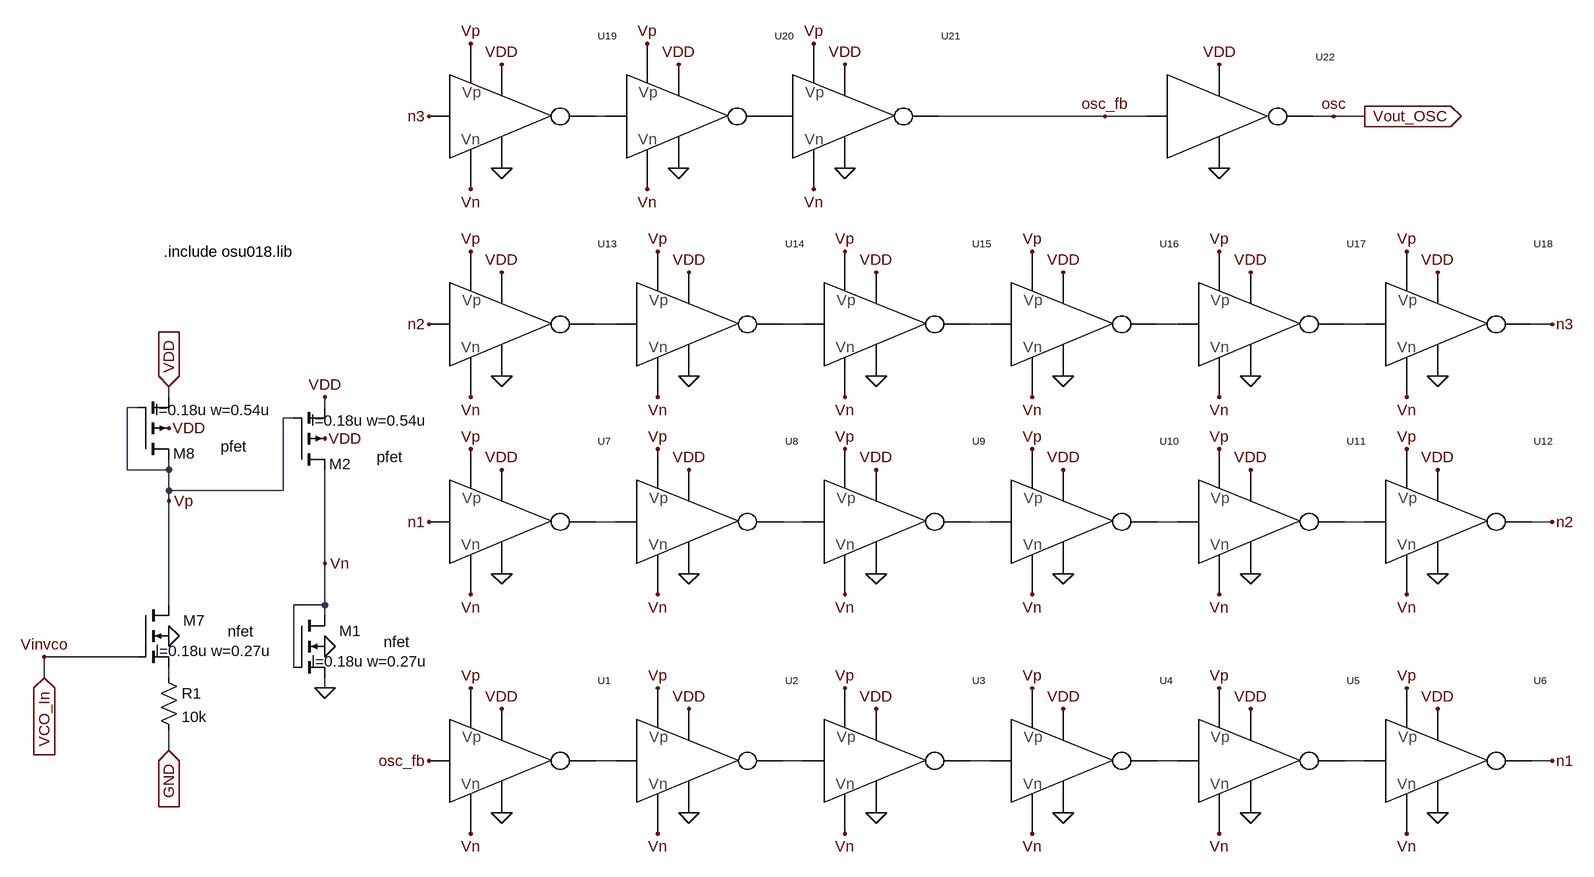
[diagram p0: schematic Z_VCO.asc]
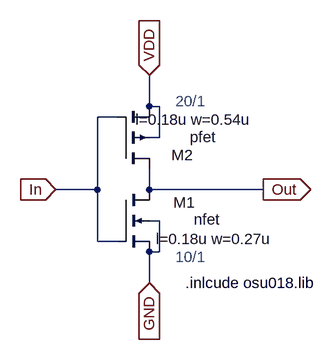
[diagram p1: sub-circuit inv_20_10.asc]
Z_VCO.asc, the LTspice schematic file:
Version 4
SHEET 1 6288 680
WIRE 1280 -1392 1264 -1392
WIRE 2048 -1392 1792 -1392
WIRE 2112 -1392 2048 -1392
WIRE 2400 -1392 2368 -1392
WIRE 2448 -1392 2400 -1392
WIRE 1296 -1072 1264 -1072
WIRE 1584 -1072 1552 -1072
WIRE 1872 -1072 1840 -1072
WIRE 2160 -1072 2128 -1072
WIRE 2448 -1072 2416 -1072
WIRE 2736 -1072 2704 -1072
WIRE 608 -960 608 -976
WIRE 560 -944 544 -944
WIRE 848 -944 848 -960
WIRE 800 -928 784 -928
WIRE 544 -848 544 -944
WIRE 608 -848 608 -864
WIRE 608 -848 544 -848
WIRE 608 -816 608 -848
WIRE 784 -816 784 -928
WIRE 784 -816 608 -816
WIRE 608 -800 608 -816
WIRE 1296 -768 1264 -768
WIRE 1584 -768 1552 -768
WIRE 1872 -768 1840 -768
WIRE 2160 -768 2128 -768
WIRE 2448 -768 2416 -768
WIRE 2736 -768 2704 -768
WIRE 848 -704 848 -848
WIRE 608 -640 608 -800
WIRE 848 -640 848 -704
WIRE 848 -640 800 -640
WIRE 848 -624 848 -640
WIRE 560 -560 416 -560
WIRE 800 -544 800 -640
WIRE 416 -528 416 -560
WIRE 608 -528 608 -544
WIRE 848 -512 848 -528
WIRE 608 -416 608 -448
WIRE 1296 -400 1264 -400
WIRE 1584 -400 1552 -400
WIRE 1872 -400 1840 -400
WIRE 2160 -400 2128 -400
WIRE 2448 -400 2416 -400
WIRE 2736 -400 2704 -400
FLAG 416 -560 Vinvco
FLAG 608 -592 0
FLAG 608 -912 VDD
FLAG 608 -800 Vp
FLAG 1120 -480 VDD
FLAG 1120 -320 0
FLAG 1072 -512 Vp
FLAG 1072 -288 Vn
FLAG 1408 -480 VDD
FLAG 1408 -320 0
FLAG 1360 -512 Vp
FLAG 1360 -288 Vn
FLAG 1696 -480 VDD
FLAG 1696 -320 0
FLAG 1648 -512 Vp
FLAG 1648 -288 Vn
FLAG 1984 -480 VDD
FLAG 1984 -320 0
FLAG 1936 -512 Vp
FLAG 1936 -288 Vn
FLAG 2272 -480 VDD
FLAG 2272 -320 0
FLAG 2224 -512 Vp
FLAG 2224 -288 Vn
FLAG 2560 -480 VDD
FLAG 2560 -320 0
FLAG 2512 -512 Vp
FLAG 2512 -288 Vn
FLAG 1120 -1472 VDD
FLAG 1120 -1312 0
FLAG 1072 -1504 Vp
FLAG 1072 -1280 Vn
FLAG 2224 -1472 VDD
FLAG 2224 -1312 0
FLAG 2400 -1392 osc
FLAG 2048 -1392 osc_fb
FLAG 1008 -400 osc_fb
FLAG 2736 -400 n1
FLAG 1008 -1392 n3
FLAG 608 -976 VDD
IOPIN 608 -976 In
FLAG 608 -416 GND
IOPIN 608 -416 In
FLAG 416 -528 VCO_In
IOPIN 416 -528 In
FLAG 2448 -1392 Vout_OSC
IOPIN 2448 -1392 Out
FLAG 848 -576 0
FLAG 848 -896 VDD
FLAG 848 -960 VDD
FLAG 848 -512 0
FLAG 848 -704 Vn
FLAG 1120 -848 VDD
FLAG 1120 -688 0
FLAG 1072 -880 Vp
FLAG 1072 -656 Vn
FLAG 1408 -848 VDD
FLAG 1408 -688 0
FLAG 1360 -880 Vp
FLAG 1360 -656 Vn
FLAG 1696 -848 VDD
FLAG 1696 -688 0
FLAG 1648 -880 Vp
FLAG 1648 -656 Vn
FLAG 1984 -848 VDD
FLAG 1984 -688 0
FLAG 1936 -880 Vp
FLAG 1936 -656 Vn
FLAG 2272 -848 VDD
FLAG 2272 -688 0
FLAG 2224 -880 Vp
FLAG 2224 -656 Vn
FLAG 2560 -848 VDD
FLAG 2560 -688 0
FLAG 2512 -880 Vp
FLAG 2512 -656 Vn
FLAG 1008 -768 n1
FLAG 2736 -768 n2
FLAG 1120 -1152 VDD
FLAG 1120 -992 0
FLAG 1072 -1184 Vp
FLAG 1072 -960 Vn
FLAG 1408 -1152 VDD
FLAG 1408 -992 0
FLAG 1360 -1184 Vp
FLAG 1360 -960 Vn
FLAG 1696 -1152 VDD
FLAG 1696 -992 0
FLAG 1648 -1184 Vp
FLAG 1648 -960 Vn
FLAG 1984 -1152 VDD
FLAG 1984 -992 0
FLAG 1936 -1184 Vp
FLAG 1936 -960 Vn
FLAG 2272 -1152 VDD
FLAG 2272 -992 0
FLAG 2224 -1184 Vp
FLAG 2224 -960 Vn
FLAG 2560 -1152 VDD
FLAG 2560 -992 0
FLAG 2512 -1184 Vp
FLAG 2512 -960 Vn
FLAG 1008 -1072 n2
FLAG 2736 -1072 n3
FLAG 1392 -1472 VDD
FLAG 1344 -1504 Vp
FLAG 1392 -1312 0
FLAG 1344 -1280 Vn
FLAG 1648 -1472 VDD
FLAG 1600 -1504 Vp
FLAG 1648 -1312 0
FLAG 1600 -1280 Vn
SYMBOL nmos4 560 -640 R0
WINDOW 0 104 24 Right 2
WINDOW 3 179 41 Right 2
WINDOW 123 207 71 Right 2
SYMATTR InstName M7
SYMATTR Value nfet
SYMATTR Value2 l=0.18u w=0.27u
SYMBOL pmos4 560 -864 M180
WINDOW 0 88 9 Right 2
WINDOW 3 168 20 Right 2
WINDOW 123 206 76 Right 2
SYMATTR InstName M8
SYMATTR Value pfet
SYMATTR Value2 l=0.18u w=0.54u
SYMBOL CS_inv 1040 -464 R0
SYMATTR InstName U1
SYMBOL CS_inv 1328 -464 R0
SYMATTR InstName U2
SYMBOL CS_inv 1616 -464 R0
SYMATTR InstName U3
SYMBOL CS_inv 1904 -464 R0
SYMATTR InstName U4
SYMBOL CS_inv 2192 -464 R0
SYMATTR InstName U5
SYMBOL CS_inv 2480 -464 R0
SYMATTR InstName U6
SYMBOL CS_inv 1040 -1456 R0
SYMATTR InstName U19
SYMBOL INV_20_10 2144 -1456 R0
SYMATTR InstName U22
SYMBOL nmos4 800 -624 R0
WINDOW 0 104 24 Right 2
WINDOW 3 179 41 Right 2
WINDOW 123 207 71 Right 2
SYMATTR InstName M1
SYMATTR Value nfet
SYMATTR Value2 l=0.18u w=0.27u
SYMBOL pmos4 800 -848 M180
WINDOW 0 88 9 Right 2
WINDOW 3 168 20 Right 2
WINDOW 123 206 76 Right 2
SYMATTR InstName M2
SYMATTR Value pfet
SYMATTR Value2 l=0.18u w=0.54u
SYMBOL res 592 -544 R0
SYMATTR InstName R1
SYMATTR Value 10k
SYMBOL CS_inv 1040 -832 R0
SYMATTR InstName U7
SYMBOL CS_inv 1328 -832 R0
SYMATTR InstName U8
SYMBOL CS_inv 1616 -832 R0
SYMATTR InstName U9
SYMBOL CS_inv 1904 -832 R0
SYMATTR InstName U10
SYMBOL CS_inv 2192 -832 R0
SYMATTR InstName U11
SYMBOL CS_inv 2480 -832 R0
SYMATTR InstName U12
SYMBOL CS_inv 1040 -1136 R0
SYMATTR InstName U13
SYMBOL CS_inv 1328 -1136 R0
SYMATTR InstName U14
SYMBOL CS_inv 1616 -1136 R0
SYMATTR InstName U15
SYMBOL CS_inv 1904 -1136 R0
SYMATTR InstName U16
SYMBOL CS_inv 2192 -1136 R0
SYMATTR InstName U17
SYMBOL CS_inv 2480 -1136 R0
SYMATTR InstName U18
SYMBOL CS_inv 1312 -1456 R0
SYMATTR InstName U20
SYMBOL CS_inv 1568 -1456 R0
SYMATTR InstName U21
TEXT 600 -1184 Left 2 !.include osu018.lib

inv_20_10.asc, the sub-circuit schematic file:
Version 4
SHEET 1 1136 680
WIRE 448 -304 448 -352
WIRE 464 -304 448 -304
WIRE 400 -288 368 -288
WIRE 464 -256 464 -304
WIRE 464 -256 448 -256
WIRE 368 -176 368 -288
WIRE 368 -176 304 -176
WIRE 448 -176 448 -208
WIRE 624 -176 448 -176
WIRE 464 -128 448 -128
WIRE 368 -96 368 -176
WIRE 400 -96 368 -96
WIRE 464 -80 464 -128
WIRE 464 -80 448 -80
WIRE 448 -32 448 -80
FLAG 304 -176 In
IOPIN 304 -176 In
FLAG 448 -352 VDD
IOPIN 448 -352 In
FLAG 448 -32 GND
IOPIN 448 -32 In
FLAG 624 -176 Out
IOPIN 624 -176 Out
SYMBOL nmos4 400 -176 R0
WINDOW 0 119 20 Right 2
WINDOW 3 157 46 Right 2
WINDOW 123 238 76 Right 2
SYMATTR InstName M1
SYMATTR Value nfet
SYMATTR Value2 l=0.18u w=0.27u
SYMBOL pmos4 400 -208 M180
WINDOW 0 116 21 Right 2
WINDOW 3 151 49 Right 2
WINDOW 123 206 76 Right 2
SYMATTR InstName M2
SYMATTR Value pfet
SYMATTR Value2 l=0.18u w=0.54u
TEXT 488 -312 Left 2 ;20/1
TEXT 488 -72 Left 2 ;10/1
TEXT 504 -32 Left 2 !.inlcude osu018.lib

The netlist it stands for:
* Z_VCO.asc
M7 Vp VCO_In N012 0 nfet l=0.18u w=0.27u
M8 Vp Vp VDD VDD pfet l=0.18u w=0.54u
XU1 osc_fb N013 Vp Vn VDD 0 CS_inv  ; pins In Out Vp Vn VDD GND
XU2 N013 N014 Vp Vn VDD 0 CS_inv  ; pins In Out Vp Vn VDD GND
XU3 N014 N015 Vp Vn VDD 0 CS_inv  ; pins In Out Vp Vn VDD GND
XU4 N015 N016 Vp Vn VDD 0 CS_inv  ; pins In Out Vp Vn VDD GND
XU5 N016 N017 Vp Vn VDD 0 CS_inv  ; pins In Out Vp Vn VDD GND
XU6 N017 n1 Vp Vn VDD 0 CS_inv  ; pins In Out Vp Vn VDD GND
XU19 n3 N001 Vp Vn VDD 0 CS_inv  ; pins In Out Vp Vn VDD GND
XU22 osc_fb Vout_OSC VDD 0 inv_20_10
M1 Vn Vn 0 0 nfet l=0.18u w=0.27u
M2 Vn Vp VDD VDD pfet l=0.18u w=0.54u
R1 N012 GND 10k
XU7 n1 N007 Vp Vn VDD 0 CS_inv  ; pins In Out Vp Vn VDD GND
XU8 N007 N008 Vp Vn VDD 0 CS_inv  ; pins In Out Vp Vn VDD GND
XU9 N008 N009 Vp Vn VDD 0 CS_inv  ; pins In Out Vp Vn VDD GND
XU10 N009 N010 Vp Vn VDD 0 CS_inv  ; pins In Out Vp Vn VDD GND
XU11 N010 N011 Vp Vn VDD 0 CS_inv  ; pins In Out Vp Vn VDD GND
XU12 N011 n2 Vp Vn VDD 0 CS_inv  ; pins In Out Vp Vn VDD GND
XU13 n2 N002 Vp Vn VDD 0 CS_inv  ; pins In Out Vp Vn VDD GND
XU14 N002 N003 Vp Vn VDD 0 CS_inv  ; pins In Out Vp Vn VDD GND
XU15 N003 N004 Vp Vn VDD 0 CS_inv  ; pins In Out Vp Vn VDD GND
XU16 N004 N005 Vp Vn VDD 0 CS_inv  ; pins In Out Vp Vn VDD GND
XU17 N005 N006 Vp Vn VDD 0 CS_inv  ; pins In Out Vp Vn VDD GND
XU18 N006 n3 Vp Vn VDD 0 CS_inv  ; pins In Out Vp Vn VDD GND
XU20 N001 P001 Vp Vn VDD 0 CS_inv  ; pins In Out Vp Vn VDD GND
XU21 P001 osc_fb Vp Vn VDD 0 CS_inv  ; pins In Out Vp Vn VDD GND

* block symbol definitions
.subckt inv_20_10 In Out VDD GND
M1 Out In GND GND nfet l=0.18u w=0.27u
M2 Out In VDD VDD pfet l=0.18u w=0.54u
* 20/1
* 10/1
.inlcude osu018.lib
.ends inv_20_10

.model NMOS NMOS
.model PMOS PMOS
.lib standard.mos
.include osu018.lib
.backanno
.end